# Altium project TCM.PrjPcb
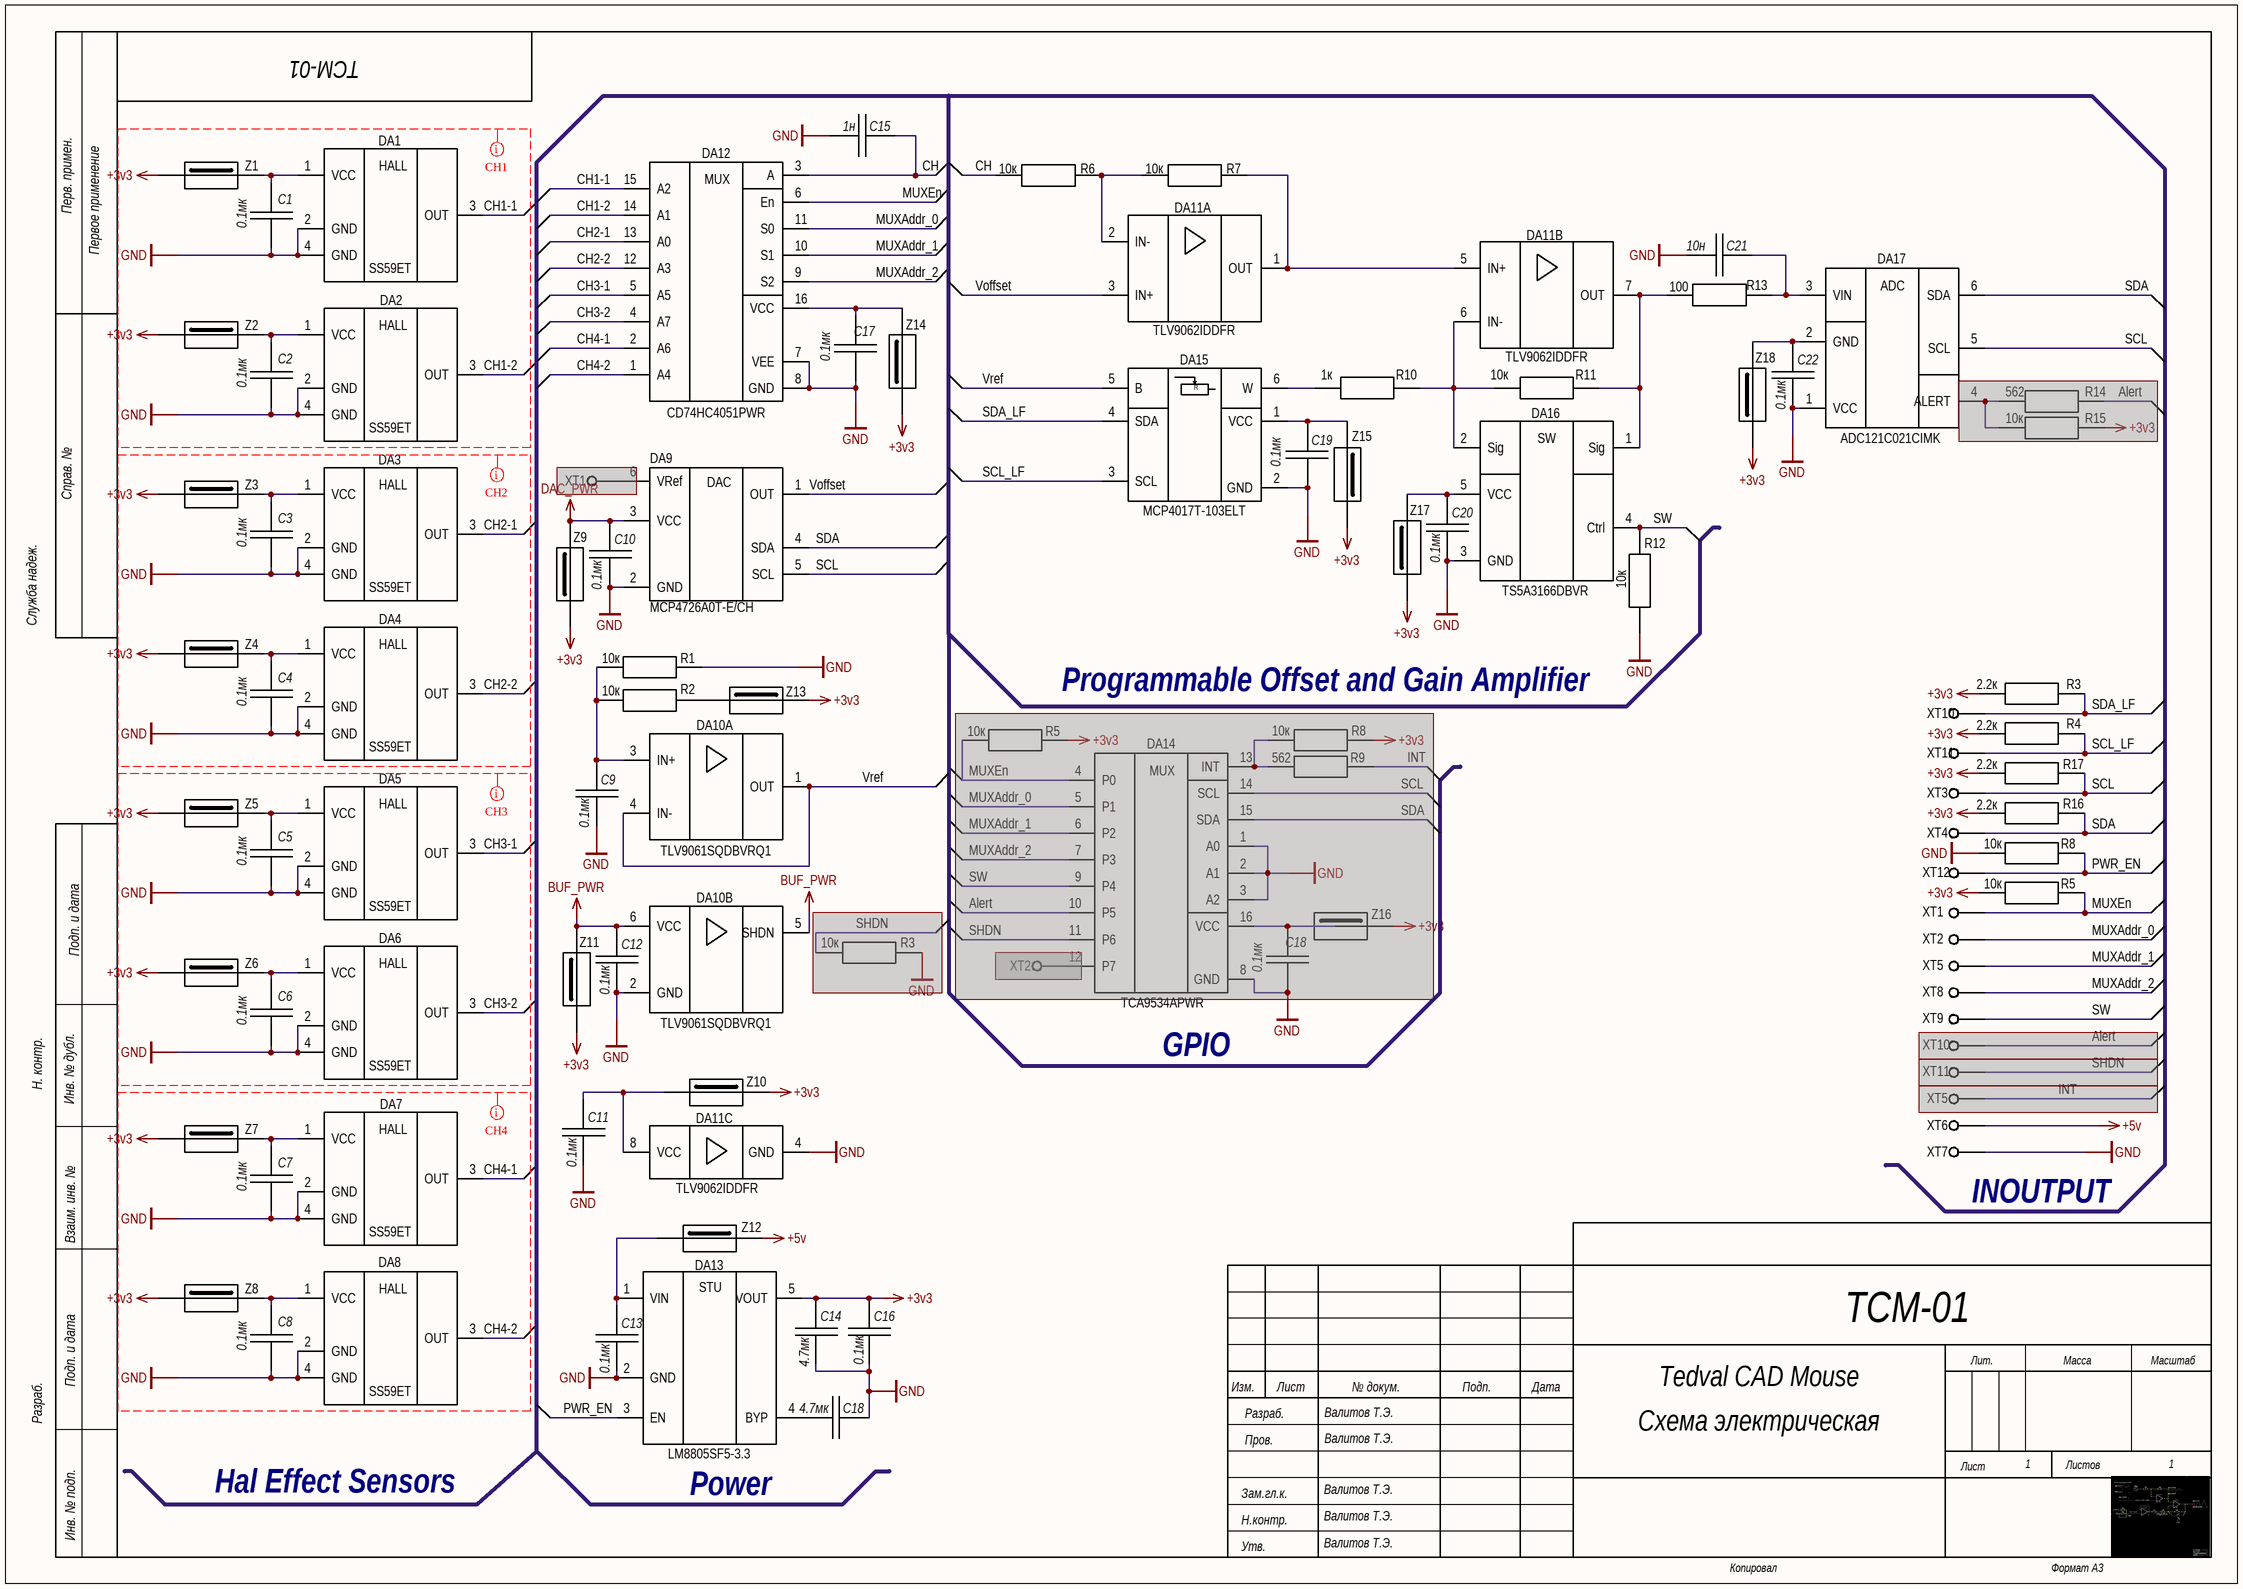
[diagram p0: TCM-01.SchDoc]
1 sheet, 95 parts. Net scope: global (net labels, ports and power ports of the same name join across sheets).
Board file: TCM-01.PcbDoc

## Sheet TCM-01.SchDoc
size 420 x 297 mm; SheetNumber: 1; SheetTotal: 1; NKontr: Валитов Т.Э.; Razrabotal: Валитов Т.Э.; Proveril: Валитов Т.Э.; ZamGlKonstr: Валитов Т.Э.; Utverdil: Валитов Т.Э.; nazvanie: Tedval CAD Mouse; SISHK: TCM-01; PervoePrimenenie: Первое применение; Rule: PcbType=ProtelPcb

### Parts
(Parts that share a designator on the sheet are numbered #1, #2 ... from top to bottom, then left to right.)
C1  0.1мк  [CC0402]
C2  0.1мк  [CC0402]
C3  0.1мк  [CC0402]
C4  0.1мк  [CC0402]
C5  0.1мк  [CC0402]
C6  0.1мк  [CC0402]
C7  0.1мк  [CC0402]
C8  0.1мк  [CC0402]
C9  0.1мк  [CC0402]
C10  0.1мк  [CC0402]
C11  0.1мк  [CC0402]
C12  0.1мк  [CC0402]
C13  0.1мк  [CC0402]
C14  4.7мк  [CC0805]
C15  1н  [CC0402]
C16  0.1мк  [CC0402]
C17  0.1мк  [CC0402]
C18#1  0.1мк  [CC0402]  (masked out: inside a compile mask, not in the netlist)
C18#2  4.7мк  [CC0805]
C19  0.1мк  [CC0402]
C20  0.1мк  [CC0402]
C21  10н  [CC0402]
C22  0.1мк  [CC0402]
DA1  SS59ET  [SOT-89B]
DA2  SS59ET  [SOT-89B]
DA3  SS59ET  [SOT-89B]
DA4  SS59ET  [SOT-89B]
DA5  SS59ET  [SOT-89B]
DA6  SS59ET  [SOT-89B]
DA7  SS59ET  [SOT-89B]
DA8  SS59ET  [SOT-89B]
DA9  MCP4726A0T-E/CH  [SOT-23-6]
DA10  TLV9061SQDBVRQ1  [SOT-23-6]  (parts A,B of 2)
DA11  TLV9062IDDFR  [SOT-23-8]  (parts A,B,C of 3)
DA12  CD74HC4051PWR  [TSSOP-16]
DA13  LM8805SF5-3.3  [SOT-23-5]
DA14  TCA9534APWR  [TSSOP-16]  (masked out: inside a compile mask, not in the netlist)
DA15  MCP4017T-103ELT  [SC-70-6]
DA16  TS5A3166DBVR  [SOT-23-5]
DA17  ADC121C021CIMK  [SOT-23-6]
R1  10к  [RC0402]
R2  10к  [RC0402]
R3#1  2.2к  [RC0402]
R3#2  10к  [RC0402]  (masked out: inside a compile mask, not in the netlist)
R4  2.2к  [RC0402]
R5#1  10к  [RC0402]  (masked out: inside a compile mask, not in the netlist)
R5#2  10к  [RC0402]
R6  10к  [RC0402]
R7  10к  [RC0402]
R8#1  10к  [RC0402]  (masked out: inside a compile mask, not in the netlist)
R8#2  10к  [RC0402]
R9  562  [RC0402]  (masked out: inside a compile mask, not in the netlist)
R10  1к  [RC0402]
R11  10к  [RC0402]
R12  10к  [RC0402]
R13  100  [RC0402]
R14  562  [RC0402]  (masked out: inside a compile mask, not in the netlist)
R15  10к  [RC0402]  (masked out: inside a compile mask, not in the netlist)
R16  2.2к  [RC0402]
R17  2.2к  [RC0402]
XT1#1  Pad  [PAD]  (value not drawn)  (masked out: inside a compile mask, not in the netlist)
XT1#2  Pad  [PAD]  (value not drawn)
XT2#1  Pad  [PAD]  (value not drawn)
XT2#2  Pad  [PAD]  (value not drawn)  (masked out: inside a compile mask, not in the netlist)
XT3  Pad  [PAD]  (value not drawn)
XT4  Pad  [PAD]  (value not drawn)
XT5#1  Pad  [PAD]  (value not drawn)
XT5#2  Pad  [PAD]  (value not drawn)  (masked out: inside a compile mask, not in the netlist)
XT6  Pad  [PAD]  (value not drawn)
XT7  Pad  [PAD]  (value not drawn)
XT8  Pad  [PAD]  (value not drawn)
XT9  Pad  [PAD]  (value not drawn)
XT10#1  Pad  [PAD]  (value not drawn)
XT10#2  Pad  [PAD]  (value not drawn)  (masked out: inside a compile mask, not in the netlist)
XT11#1  Pad  [PAD]  (value not drawn)
XT11#2  Pad  [PAD]  (value not drawn)  (masked out: inside a compile mask, not in the netlist)
XT12  Pad  [PAD]  (value not drawn)
Z1  FB  [IND0402]  (value not drawn)
Z2  FB  [IND0402]  (value not drawn)
Z3  FB  [IND0402]  (value not drawn)
Z4  FB  [IND0402]  (value not drawn)
Z5  FB  [IND0402]  (value not drawn)
Z6  FB  [IND0402]  (value not drawn)
Z7  FB  [IND0402]  (value not drawn)
Z8  FB  [IND0402]  (value not drawn)
Z9  FB  [IND0402]  (value not drawn)
Z10  FB  [IND0402]  (value not drawn)
Z11  FB  [IND0402]  (value not drawn)
Z12  FB  [IND0402]  (value not drawn)
Z13  FB  [IND0402]  (value not drawn)
Z14  FB  [IND0402]  (value not drawn)
Z15  FB  [IND0402]  (value not drawn)
Z16  FB  [IND0402]  (value not drawn)  (masked out: inside a compile mask, not in the netlist)
Z17  FB  [IND0402]  (value not drawn)
Z18  FB  [IND0402]  (value not drawn)

### Nets
+3v3: C14.2(GND) C16.2(GND) DA13.5(VOUT) R3#1.1(GND) R4.1(GND) R5#2.1(GND) R16.1(GND) R17.1(GND) Z1.1(GND) Z2.1(GND) Z3.1(GND) Z4.1(GND) Z5.1(GND) Z6.1(GND) Z7.1(GND) Z8.1(GND) Z9.1(GND) Z10.2(GND) Z11.1(GND) Z13.1(GND) Z14.1(GND) Z15.1(GND) Z17.1(GND) Z18.1(GND)
+5v: XT6.1 Z12.2(GND)
BUF_PWR: C12.2(GND) DA10.5(SHDN) DA10.6(VCC) Z11.2(GND)
DAC_PWR: C10.2(GND) DA9.3(VCC) Z9.2(GND)
GND: C1.1(GND) C2.1(GND) C3.1(GND) C4.1(GND) C5.1(GND) C6.1(GND) C7.1(GND) C8.1(GND) C9.1(GND) C10.1(GND) C11.1(GND) C12.1(GND) C13.1(GND) C14.1(GND) C15.1(GND) C16.1(GND) C17.1(GND) C18#2.1(GND) C19.1(GND) C20.1(GND) C21.2(GND) C22.1(GND) DA1.2(GND) DA1.4(GND) DA2.2(GND) DA2.4(GND) DA3.2(GND) DA3.4(GND) DA4.2(GND) DA4.4(GND) DA5.2(GND) DA5.4(GND) DA6.2(GND) DA6.4(GND) DA7.2(GND) DA7.4(GND) DA8.2(GND) DA8.4(GND) DA9.2(GND) DA10.2(GND) DA11.4(GND) DA12.7(VEE) DA12.8(GND) DA13.2(GND) DA15.2(GND) DA16.3(GND) DA17.1(VCC) R1.1(GND) R8#2.1(GND) R12.1(GND) XT7.1
CH: C15.2(GND) DA12.3(A) R6.1(GND)
CH1-1: DA1.3(OUT) DA12.15(A2)
CH1-2: DA2.3(OUT) DA12.14(A1)
CH2-1: DA3.3(OUT) DA12.13(A0)
CH2-2: DA4.3(OUT) DA12.12(A3)
CH3-1: DA5.3(OUT) DA12.5(A5)
CH3-2: DA6.3(OUT) DA12.4(A7)
CH4-1: DA7.3(OUT) DA12.2(A6)
CH4-2: DA8.3(OUT) DA12.1(A4)
MUXAddr_0: DA12.11(S0) XT2#1.1
MUXAddr_1: DA12.10(S1) XT5#1.1
MUXAddr_2: DA12.9(S2) XT8.1
MUXEn: DA12.6(En) R5#2.2(GND) XT1#2.1
PWR_EN: DA13.3(EN) R8#2.2(GND) XT12.1
SCL: DA9.5(SCL) DA17.5(SCL) R17.2(GND) XT3.1
SCL_LF: DA15.3(SCL) R4.2(GND) XT11#1.1
SDA: DA9.4(SDA) DA17.6(SDA) R16.2(GND) XT4.1
SDA_LF: DA15.4(SDA) R3#1.2(GND) XT10#1.1
SW: DA16.4(Ctrl) R12.2(GND) XT9.1
Voffset: DA9.1(OUT) DA11.3(IN+)
Vref: DA10.1(OUT) DA10.4(IN-) DA15.5(B)
NetC1_2: C1.2(GND) DA1.1(VCC) Z1.2(GND)
NetC2_2: C2.2(GND) DA2.1(VCC) Z2.2(GND)
NetC3_2: C3.2(GND) DA3.1(VCC) Z3.2(GND)
NetC4_2: C4.2(GND) DA4.1(VCC) Z4.2(GND)
NetC5_2: C5.2(GND) DA5.1(VCC) Z5.2(GND)
NetC6_2: C6.2(GND) DA6.1(VCC) Z6.2(GND)
NetC7_2: C7.2(GND) DA7.1(VCC) Z7.2(GND)
NetC8_2: C8.2(GND) DA8.1(VCC) Z8.2(GND)
NetC9_2: C9.2(GND) DA10.3(IN+) R1.2(GND) R2.2(GND)
NetC11_2: C11.2(GND) DA11.8(VCC) Z10.1(GND)
NetC13_2: C13.2(GND) DA13.1(VIN) Z12.1(GND)
NetC17_2: C17.2(GND) DA12.16(VCC) Z14.2(GND)
NetC18#2_2: C18#2.2(GND) DA13.4(BYP)
NetC19_2: C19.2(GND) DA15.1(VCC) Z15.2(GND)
NetC20_2: C20.2(GND) DA16.5(VCC) Z17.2(GND)
NetC21_1: C21.1(GND) DA17.3(VIN) R13.2(GND)
NetC22_2: C22.2(GND) DA17.2(GND) Z18.2(GND)
NetDA11_1: DA11.1(OUT) DA11.5(IN+) R7.2(GND)
NetDA11_2: DA11.2(IN-) R6.2(GND) R7.1(GND)
NetDA11_6: DA11.6(IN-) DA16.2(Sig) R10.2(GND) R11.1(GND)
NetDA11_7: DA11.7(OUT) DA16.1(Sig) R11.2(GND) R13.1(GND)
NetDA15_6: DA15.6(W) R10.1(GND)
NetR2_1: R2.1(GND) Z13.2(GND)

Not connected (* = marked no-connect by the designer): DA9 6(VRef); DA17 4(ALERT)

### Layout directives
CompClassName: CH1: +3v3, CH1-1, CH1-2, GND
CompClassName: CH2: +3v3, CH2-1, CH2-2, GND
CompClassName: CH3: +3v3, CH3-1, CH3-2, GND
CompClassName: CH4: +3v3, CH4-1, CH4-2, GND

### Notes on the sheet
- Programmable Offset and Gain Amplifier
- (near DA14) GPIO
- (near XT7) INOUTPUT
- Hal Effect Sensors
- Power
- Перв. примен.
- Справ. №
- Служба надеж.
- Подп. и дата
- Н. контр.
- Инв. № дубл.
- Взаим. инв. №
- Разраб.
- Изм.
- Лист
- № докум.
- Подп.
- Дата
- Лит.
- Масса
- Масштаб
- Пров.
- Схема электрическая
  принципиальная
- Листов
- Инв. № подп.
- Утв.
- Н.контр.
- Зам.гл.к.
- Копировал
- Формат А3
- (in symbol ADC121C021CIMK) ADC
- (in symbol CD74HC4051PWR) MUX
- (in symbol LM8805SF5-3.3) STU
- (in symbol MCP4017T-103ELT) R
- (in symbol MCP4726A0T-E/CH) DAC
- (in symbol SS59ET) HALL
- (in symbol TCA9534APWR) MUX
- (in symbol TS5A3166DBVR) SW

### Library data of the parts
C1-C17 C18#1 C18#2 C19-C22 = Capacitor
  C1-C13 C16 C17 C18#1 C19 C20 C22: Volume: 0.1мк
  C14 C18#2: Volume: 4.7мк
  C15: Volume: 1н
  C21: Volume: 10н
DA1-DA8 = SS59ET: SS59ET Honeywell Linear Hall-effect sensor
DA9 = MCP4726A0T-E/CH: MCP4726A0T-E/CH DAC 12-bit
DA10 = TLV9061SQDBVRQ1: Automotive, single, 5.5-V 10-MHz rail-to-rail input and output operational amplifier 6-SOT-23 -40 to 125
DA11 = TLV9062IDDFR: TLV9062IDDFR 2-gate OPAMP
DA12 = CD74HC4051PWR: 5-V, 8:1, 1-channel analog multiplexer 16-TSSOP -55 to 125
DA13 = LM8805SF5-3.3: The LM8805 series is a low-dropout linear regulator. / There are devices designed specifically for batteryoperated systems. Ground current is very small (50uATyp), that significantly extending battery life. Low power / consumption and high accuracy is achieved through / CMOS and programmable fuse technologies. Output / voltage: 1.5V to 6.0V.
DA14 = TCA9534APWR: 8-bit 1.65- to 5.5-V I2C/SMBus I/O expander with interrupt, & config registers 16-TSSOP -40 to 85
DA15 = MCP4017T-103ELT: MCP4018T-103ELT Digital Rheostat 10k
DA16 = TS5A3166DBVR: 0.9Ohm on-state resistance, 5-V, 1:1 (SPST), 1-channel analog switch (active high) 5-SOT-23 -40 to 85
DA17 = ADC121C021CIMK: I2C-Compatible, 12-Bit Analog-to-Digital Converter with Alert Pin 6-SOT-23-THIN -40 to 105
R1 R2 R3#1 R3#2 R4 R5#1 R5#2 R6 R7 R8#1 R8#2 R9-R17 = Resistor
  R13: Volume: 100